# EasyEDA Pro project can-mcu.eprj, board host-dimmer-rgbw
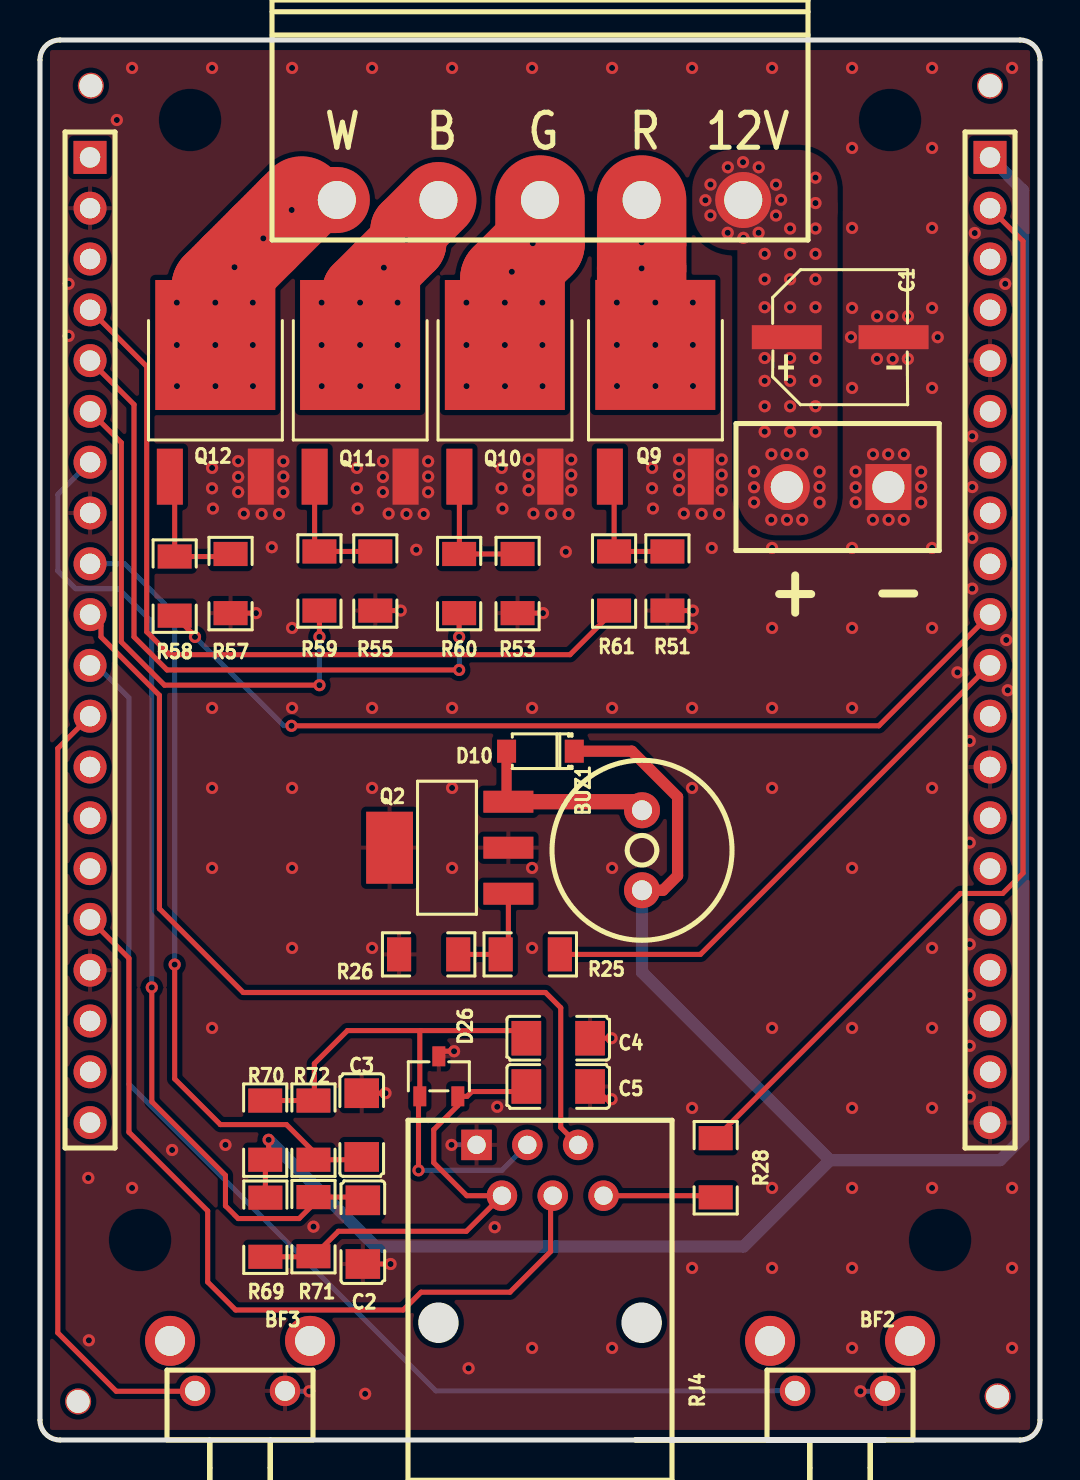
[diagram p13: board, top side]
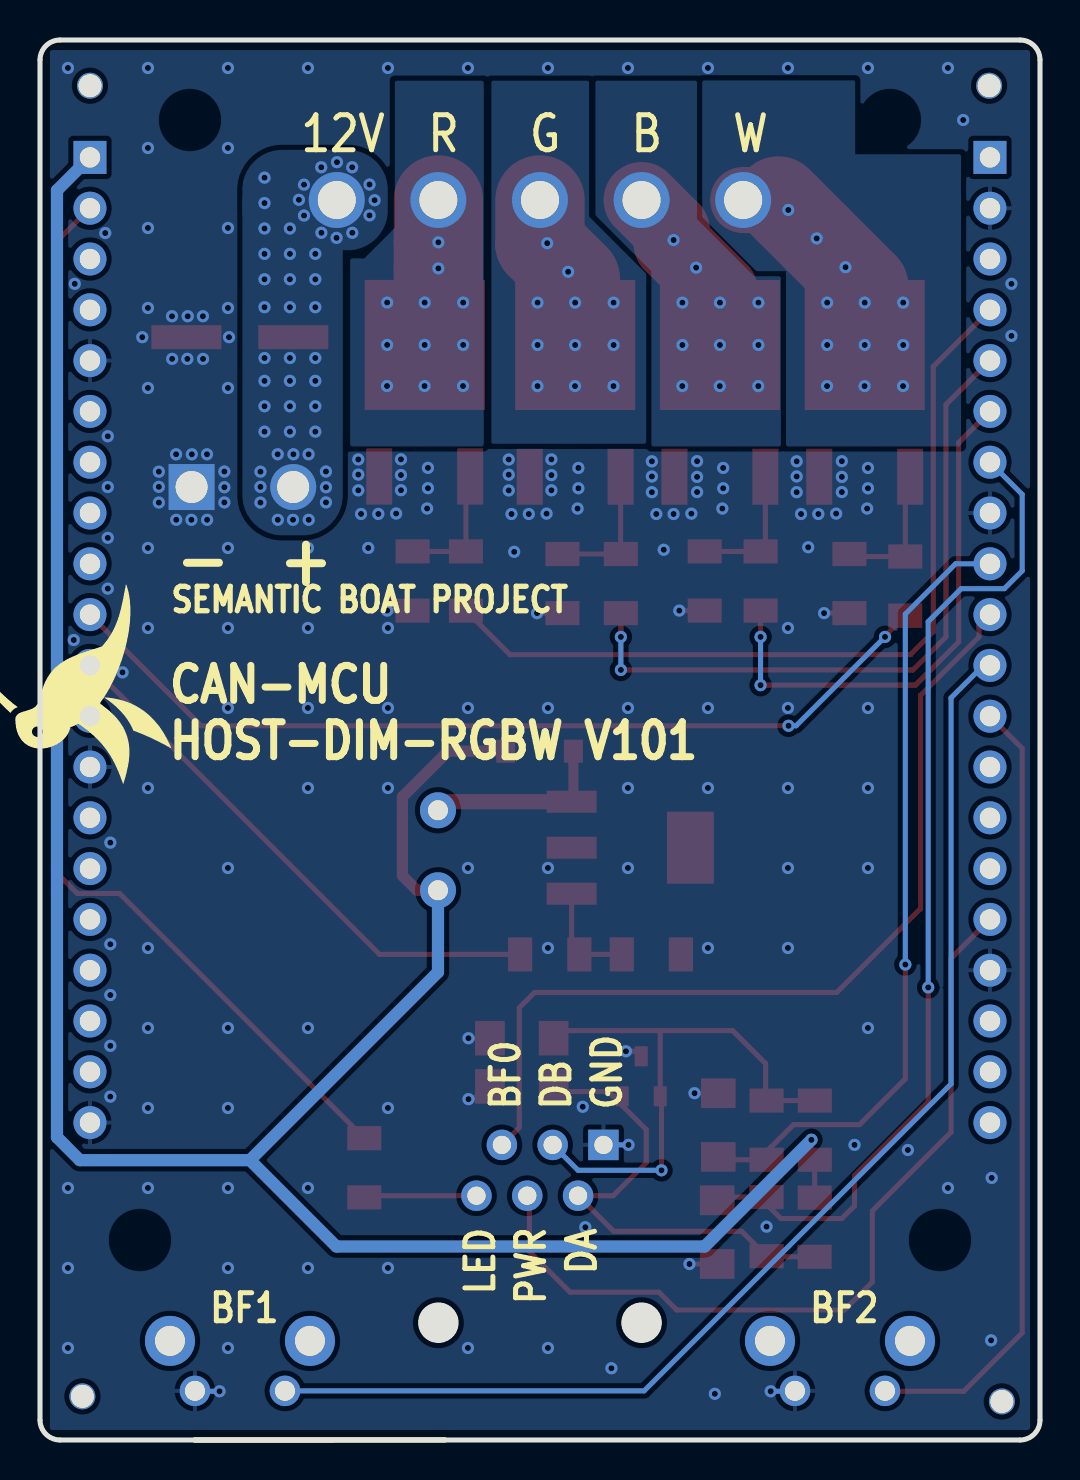
[diagram p14: board, bottom side, seen from below]

Outline 50 x 70 mm; copper layers: Top Layer, Bottom Layer. Coordinates in mm from the lower left corner of the outline.
Outline path: 1,0 arc(0.29,0.29) 0,1 0,69 arc(0.29,69.71) 1,70 49,70 arc(49.71,69.71) 50,69 50,1 arc(49.71,0.29) 49,0 29.76,0 42.26,0 1.02,0
Stack: Top Layer 0.035mm / Dielectric1 1.51mm FR4 er 4.5 / Bottom Layer 0.035mm

## Design rules (mm)
template: Custom Config
spacing copperThickness1oz (default): track to track 0.102, other pairs 0.152 to 0.3
spacing copperThickness2oz: track to track 0.203, other pairs 0.152 to 0.3
track width copperThickness1oz (default): min 0.127, default 0.254, max 5.08
track width copperThickness2oz: min 0.203, default 0.254, max 2.54
differential pair differentialPair (default): width min 0.127, default 0.254, max 2.54; gap min 0.152, default 0.152
via viaSize (default): diameter min 0.5, default 0.61, max 10; hole min 0.3, default 0.305, max 6.3

## Placement (name value [footprint] x y rotation side)
BF2  TC-6615-8-260G  [SW-TH_4P-L7.5-W8.0-P4.50]  40 3.71 180 top
BF3  TC-6615-8-260G  [SW-TH_4P-L7.5-W8.0-P4.50]  10 3.71 180 top
BUZ1  2.7kHz  [BUZ-TH_BD9.0-P4.00-D0.6-FD]  30.1 29.49 90 top
C1  100uF  [CAP-SMD_BD6.3-L6.6-W6.6-LS7.3-FD-H7.7]  40.01 55.14 0 top
C2  10nF  [C1206]  16.14 10.39 90 top
C3  10nF  [C1206]  16.09 15.75 270 top
C4  10nF  [C1206]  25.91 20.09 180 top
C5  10nF  [C1206]  25.91 17.68 180 top
CN3  DB2ERC-5.08-5P-GN  [CONN-TH_5P-P5.08_DB2ERC-5.08-5P]  25 62 180 top
D10  1N4148W  [SOD-123_L2.8-W1.8-LS3.7-RD]  25.02 34.44 180 top
D26  PESD3V3S2UT  [SOT-23-3_L2.9-W1.3-P1.90-LS2.4-BR]  19.94 18.18 270 top
NOREF  -  [Pad_e665]  1.91 1.93 270 top
NOREF#2  -  [Pad_e664]  47.88 2.18 270 top
NOREF#3  -  [Pad_e663]  2.54 67.71 270 top
NOREF#4  -  [Pad_e3264]  47.5 67.71 270 top
Q2  TE060NDG  [SOT-223-3_L6.5-W3.4-P2.30-LS7.0-BR-1]  20.45 29.61 0 top
Q9  AOD4184A  [TO-252-2_L6.6-W6.1-P4.57-LS9.9-TL-CW]  30.77 51.46 90 top
Q10  AOD4184A  [TO-252-2_L6.6-W6.1-P4.57-LS9.9-TL-CW]  23.24 51.46 90 top
Q11  AOD4184A  [TO-252-2_L6.6-W6.1-P4.57-LS9.9-TL-CW]  16 51.46 90 top
Q12  AOD4184A  [TO-252-2_L6.6-W6.1-P4.57-LS9.9-TL-CW]  8.77 51.46 90 top
R25  220Ω  [R1206]  24.51 24.28 180 top
R26  47kΩ  [R1206]  19.43 24.28 0 top
R28  1kΩ  [R1206]  33.78 13.61 90 top
R51  47kΩ  [R1206]  31.37 42.95 270 top
R53  47kΩ  [R1206]  23.88 42.82 270 top
R55  47kΩ  [R1206]  16.77 42.95 270 top
R57  47kΩ  [R1206]  9.53 42.82 270 top
R58  220Ω  [R1206]  6.73 42.69 90 top
R59  220Ω  [R1206]  13.97 42.95 90 top
R60  220Ω  [R1206]  20.96 42.82 90 top
R61  220Ω  [R1206]  28.7 42.95 90 top
R69  10kΩ  [R1206]  11.27 10.64 90 top
R70  10kΩ  [R1206]  11.26 15.49 270 top
R71  1kΩ  [R1206]  13.67 10.67 90 top
R72  1kΩ  [R1206]  13.67 15.49 270 top
RJ4  MTJ-665X1  [RE45-TH_MTJ-665X1]  25 13.48 0 top
U1  PZ508V-11-02P-H25  [HDR-TH_2P-P5.08-V-M]  39.88 47.65 180 top
U3  KH-2.54FH-1X20P-H8.5  [HDR-TH_20P-P2.54-V-F-2]  47.5 40 270 top
U4  KH-2.54FH-1X20P-H8.5  [HDR-TH_20P-P2.54-V-F-2]  2.5 40 270 top

## Footprints (pads in the part's own frame, mm; a bottom-side part is the same pattern mirrored in y, then rotated)
BUZ-TH_BD9.0-P4.00-D0.6-FD
  round 1.8 hole 1: 1(-2,0) 2(2,0)
C1206
  rect 1.485x1.728 smd: 1(-1.593,0) 2(1.593,0)
CAP-SMD_BD6.3-L6.6-W6.6-LS7.3-FD-H7.7
  rect 3.5x1.2 smd: 1(-2.67,0) 2(2.67,0)
CONN-TH_5P-P5.08_DB2ERC-5.08-5P
  round 2.8 hole 1.9: 1(-10.16,0) 2(-5.08,0) 3(0,0) 4(5.08,0) 5(10.16,0)
HDR-TH_2P-P5.08-V-M
  rect 2.3x2.3 hole 1.6: 1(-2.54,0)
  round 2.3 hole 1.6: 2(2.54,0)
HDR-TH_20P-P2.54-V-F-2
  rect 1.65x1.65 hole 1.02: 1(-24.13,0)
  round 1.65 hole 1.02: 2(-21.59,0) 3(-19.05,0) 4(-16.51,0) 5(-13.97,0) 6(-11.43,0) 7(-8.89,0) 8(-6.35,0) 9(-3.81,0) 10(-1.27,0) 11(1.27,0) 12(3.81,0) 13(6.35,0) 14(8.89,0) 15(11.43,0) 16(13.97,0) 17(16.51,0) 18(19.05,0) 19(21.59,0) 20(24.13,0)
Pad_e663
  round 1.3 hole 1.152: 1(0,0)
Pad_e664
  round 1.3 hole 1.152: 1(0,0)
Pad_e665
  round 1.3 hole 1.152: 1(0,0)
Pad_e3264
  round 1.3 hole 1.152: 1(0,0)
R1206
  rect 1.208x1.701 smd: 1(-1.479,0) 2(1.479,0)
RE45-TH_MTJ-665X1
  rect 1.524x1.524 hole 0.914: 1(-3.175,1.27)
  round 1.524 hole 0.914: 2(-1.905,-1.27) 3(-0.635,1.27) 4(0.635,-1.27) 5(1.905,1.27) 6(3.175,-1.27)
SOD-123_L2.8-W1.8-LS3.7-RD
  rect 0.95x1.15 smd: 1(-1.692,0) 2(1.692,0)
SOT-23-3_L2.9-W1.3-P1.90-LS2.4-BR
  rect 1x0.65 smd: 1(1,-0.95) 2(1,0.95) 3(-1,0)
SOT-223-3_L6.5-W3.4-P2.30-LS7.0-BR-1
  rect 2.5x1.1 smd: 1(2.97,-2.3) 2(2.97,0) 3(2.97,2.3)
  rect 2.34x3.6 smd: 2(-2.97,0)
SW-TH_4P-L7.5-W8.0-P4.50
  round 1.524 hole 1: 1(-2.25,1.25) 2(2.25,1.25)
  round 2.5 hole 1.5: 3(-3.5,-1.25) 4(3.5,-1.25)
TO-252-2_L6.6-W6.1-P4.57-LS9.9-TL-CW
  rect 2.8x1.3 smd: 1(-3.292,2.273) 3(-3.292,-2.273)
  rect 6.5x6 smd: 2(3.292,0)

## Nets
+3V3: BUZ1.1 D10.1 R69.2 R70.2 U3.1
+12V: C1.1 CN3.1 U1.2
GND: BF2.1 BF3.1 C1.2 C2.1 C3.1 C4.1 C5.1 D26.3 Q2.2 Q9.3 Q10.3 Q11.3 Q12.3 R26.1 R51.2 R53.2 R55.2 R57.2 RJ4.1 U1.1 U3.5 U3.13 U3.20 U4.2 U4.8 U4.17
BTN_FUN_0: RJ4.5 U4.10
BTN_FUN_1: BF2.2 U4.11
BTN_FUN_2: BF3.2 U4.12
BTN_POWER: RJ4.4 U4.16
DEC_A: C5.2 D26.2 R69.1 R71.1 RJ4.2
DEC_B: C4.2 D26.1 R70.1 R72.1 RJ4.3
GPIO_PA0_T21: C2.2 R71.2 U4.7
GPIO_PA1_T22: C3.2 R72.2 U4.9
GPIO_PA2_T23: R58.1 U3.10
GPIO_PA3_T24: R25.1 U3.11
GPIO_PA4_D_CS: R28.2 U3.2
GPIO_PA8_T11: R61.1 U4.4
GPIO_PA9_T12: R60.1 U4.5
GPIO_PA10_T13: R59.1 U4.6
$1N6097: BUZ1.2 D10.2 Q2.3
$1N6717: Q2.1 R25.2 R26.2
$1N12573: CN3.2 Q9.2
$1N12577: Q9.1 R51.1 R61.2
$1N13127: CN3.3 Q10.2
$1N13130: Q10.1 R53.1 R60.2
$1N13391: CN3.4 Q11.2
$1N13394: Q11.1 R55.1 R59.2
$1N13399: Q12.1 R57.1 R58.2
$1N13465: CN3.5 Q12.2
$1N13717: R28.1 RJ4.6

Pads without a net: BF2 3 4; BF3 3 4; NOREF 1; NOREF#2 1; NOREF#3 1; NOREF#4 1; U3 3 4 6 7 8 9 12 14 15 16 17 18 19; U4 1 3 13 14 15 18 19 20

## Via types
v1: diameter 0.61, hole 0.305, Top Layer to Bottom Layer, 289 vias

## Routing (per net, layer and track width the routed paths; a pad name or vN(x,y) marks a point on that pad's centre or on a via; arc(x,y) is an arc through that point)
+3V3: length 124.3
  Top Layer w0.254: R69.2 11.27,14.01 R70.2 11.43,14.19 v1(11.43,15.01)
  Top Layer w0.559: D10.1 29.59,34.44 31.88,32.15 31.88,28.22 31.15,27.49 BUZ1.1
  Bottom Layer w0.61: BUZ1.1 30.1,23.39 39.5,13.99 ; v1(11.43,15.01) 16.77,9.68 35.18,9.68 39.5,13.99 ; U3.1 49.15,62.48 49.15,15.14 48.01,13.99 39.5,13.99
+12V:
  vias: v1(33.27,61.99) v1(33.52,62.78) v1(33.52,61.23) v1(34.39,63.64) v1(34.39,60.36) v1(35.15,63.89) v1(35.17,60.11) v1(35.7,48.42) v1(35.7,47.64) v1(35.7,46.88) v1(35.94,63.64) v1(35.93,60.36) v1(36.24,59.31) v1(36.24,58.04) v1(36.24,56.64) v1(36.24,54.1) v1(36.24,52.96) v1(36.24,51.69) v1(36.24,50.42) v1(36.57,49.29) v1(36.56,46.01) v1(36.8,62.77) v1(36.8,61.22) v1(37.05,62.01) v1(37.33,49.29) v1(37.35,46.01) v1(37.51,60.58) v1(37.51,59.31) v1(37.51,58.04) v1(37.51,56.64) v1(37.51,54.1) v1(37.51,52.96) v1(37.51,51.69) v1(37.51,50.42) v1(38.12,49.29) v1(38.11,46.01) v1(38.78,63.12) v1(38.78,61.85) v1(38.78,60.58) v1(38.78,59.31) v1(38.78,58.04) v1(38.78,56.64) v1(38.78,54.1) v1(38.78,52.96) v1(38.78,51.69) v1(38.78,50.42) v1(38.98,48.42) v1(38.98,47.66) v1(38.98,46.87)
GND: length 14.6
  Top Layer w0.254: C5.1 27.69,17.68 28.32,17.04 v1(28.58,17.04) ; R53.2 v1(25.15,41.34) ; C2.1 v1(17.53,8.8) ; C3.1 v1(17.27,17.34) ; R51.2 v1(32.64,41.47) ; C4.1 v1(28.58,20.09) ; R55.2 v1(18.04,41.47) ; R57.2 v1(10.8,41.34) ; v1(20.7,19.44) 20.2,19.44 D26.3
  Bottom Layer w0.254: v1(13.46,2.44) 12.27,2.44 BF3.1 ; RJ4.1 v1(20.58,14.75) ; v1(41.02,2.44) 42.23,2.44 BF2.1
  vias: v1(1.43,57.81) v1(1.43,55.21) v1(2.42,13.1) v1(2.44,4.98) v1(3.84,66) v1(4.6,68.6) v1(4.6,12.6) v1(6.61,14.5) v1(8.6,68.6) v1(8.6,48.6) v1(8.6,47.59) v1(8.65,46.57) v1(8.6,36.6) v1(8.6,32.6) v1(8.6,28.6) v1(8.6,20.6) v1(9.27,14.75) v1(9.91,48.94) v1(9.91,48.16) v1(9.91,47.4) v1(10.19,46.32) v1(11.08,46.3) v1(11.59,44.64) v1(11.95,46.3) v1(12.17,48.94) v1(12.17,48.18) v1(12.17,47.39) v1(12.6,68.6) v1(12.6,40.6) v1(12.6,36.6) v1(12.6,32.6) v1(12.6,28.6) v1(12.6,24.6) v1(13.67,10.67) v1(15.84,48.6) v1(15.84,47.59) v1(15.88,46.57) v1(16.26,2.31) v1(16.6,68.6) v1(16.6,36.6) v1(16.6,32.6) v1(16.6,24.6) v1(17.15,48.94) v1(17.15,48.16) v1(17.15,47.4) v1(17.43,46.32) v1(18.32,46.3) v1(18.81,44.51) v1(19.19,46.3) v1(19.41,48.94) v1(19.41,48.18) v1(19.41,47.39) v1(20.6,68.6) v1(20.6,36.6) v1(20.6,32.6) v1(20.6,28.6) v1(21.43,3.59) v1(22.74,10.64) v1(22.86,16.66) v1(23.08,48.6) v1(23.08,47.59) v1(23.12,46.57) v1(24.43,49.03) v1(24.43,48.25) v1(24.43,47.49) v1(24.6,68.6) v1(24.6,36.6) v1(24.6,28.6) v1(24.6,24.6) v1(24.6,4.6) v1(24.67,46.32) v1(25.56,46.3) v1(26.29,44.41) v1(26.43,46.3) v1(26.56,49.02) v1(26.56,48.27) v1(26.56,47.48) v1(28.6,68.6) v1(28.6,36.6) v1(28.6,28.6) v1(28.6,4.6) v1(30.6,48.61) v1(30.6,47.59) v1(30.65,46.58) v1(31.95,49.03) v1(31.95,48.25) v1(31.95,47.49) v1(32.19,46.32) v1(32.6,68.6) v1(32.6,40.6) v1(32.6,36.6) v1(32.6,32.6) v1(32.6,16.6) v1(32.6,8.6) v1(33.08,46.3) v1(33.59,44.6) v1(33.95,46.3) v1(34.09,49.03) v1(34.09,48.27) v1(34.09,47.48) v1(36.6,68.6) v1(36.6,44.6) v1(36.6,40.6) v1(36.6,36.6) v1(36.6,32.6) v1(36.6,20.6) v1(36.6,12.6) v1(36.6,8.6) v1(40.55,55.14) v1(40.6,68.6) v1(40.6,64.6) v1(40.6,60.6) v1(40.6,56.6) v1(40.6,52.6) v1(40.6,44.6) v1(40.6,40.6) v1(40.6,36.6) v1(40.6,28.6) v1(40.6,20.6) v1(40.6,16.6) v1(40.6,12.6) v1(40.6,8.6) v1(40.6,4.6) v1(40.78,48.42) v1(40.78,47.64) v1(40.78,46.88) v1(41.65,49.29) v1(41.64,46.01) v1(41.85,54.06) v1(41.86,56.19) v1(42.41,49.29) v1(42.43,46.01) v1(42.61,56.19) v1(42.63,54.06) v1(43.2,49.29) v1(43.19,46.01) v1(43.4,56.19) v1(43.39,54.06) v1(44.06,48.42) v1(44.06,47.66) v1(44.06,46.87) v1(44.6,68.6) v1(44.6,64.6) v1(44.6,60.6) v1(44.6,56.6) v1(44.6,52.6) v1(44.6,44.6) v1(44.6,40.6) v1(44.6,32.6) v1(44.6,24.6) v1(44.6,20.6) v1(44.6,16.6) v1(44.6,12.6) v1(44.89,55.14) v1(45.87,38.38) v1(46.48,34.95) v1(46.48,29.87) v1(46.48,24.79) v1(46.48,22.25) v1(46.48,19.71) v1(46.48,17.17) v1(46.61,50.19) v1(46.61,47.65) v1(46.61,45.11) v1(46.61,42.57) v1(46.74,60.35) v1(48.26,57.81) v1(48.31,40) v1(48.39,37.49) v1(48.6,68.6) v1(48.6,12.6) v1(48.6,8.6) v1(48.6,4.6)
BTN_FUN_0: length 45.5
  Top Layer w0.254: RJ4.5 26.04,15.62 26.04,21.61 25.28,22.38 10.16,22.38 5.97,26.57 5.97,37.23 3.05,40.16 3.05,40.72 U4.10
BTN_FUN_1: length 61.6
  Bottom Layer w0.254: BF2.2 19.79,2.46 4.45,17.8 4.45,37.11 2.82,38.73 U4.11
BTN_FUN_2: length 39.6
  Top Layer w0.254: BF3.2 7.73,2.44 3.81,2.44 0.89,5.36 0.89,34.58 U4.12
BTN_POWER: length 42.3
  Top Layer w0.254: U4.16 4.45,24.08 4.45,15.39 8.38,11.45 8.38,7.9 9.78,6.5 18.16,6.5 19.05,7.39 23.5,7.39 25.53,9.42 25.53,12.11 RJ4.4
DEC_A: length 24.6
  Top Layer w0.254: R69.1 13.65,9.16 R71.1 14.92,10.44 21.32,10.44 RJ4.2 21.34,12.22 19.69,13.87 19.69,15.52 20.89,16.72 D26.2 21.35,17.18 21.59,17.42 24.06,17.42 C5.2
DEC_B: length 28.7
  Top Layer w0.254: 19.04,20.47 18.99,20.42 D26.1 18.93,17.12 v1(18.93,13.48) ; 19.04,20.47 23.94,20.47 C4.2 ; 19.04,20.47 15.37,20.47 13.72,18.82 13.72,17.02 R72.1 R70.1
  Bottom Layer w0.254: v1(18.93,13.48) 23.1,13.48 RJ4.3
GPIO_PA0_T21: length 50.4
  Top Layer w0.254: v1(5.59,22.63) 5.59,16.91 9.27,13.23 9.27,11.71 9.91,11.07 12.96,11.07 13.67,11.79 R71.2 15.98,12.15 C2.2
  Bottom Layer w0.254: U4.7 0.89,47.28 0.89,43.46 1.78,42.57 3.94,42.57 5.59,40.92 v1(5.59,22.63)
GPIO_PA1_T22: length 39.8
  Top Layer w0.254: v1(6.73,23.77) 6.73,18.06 9.02,15.77 12.32,15.77 13.67,14.42 R72.2 15.95,14.01 C3.2
  Bottom Layer w0.254: U4.9 4.22,43.81 6.73,41.3 v1(6.73,23.77)
GPIO_PA2_T23: length 45.4
  Top Layer w0.254: v1(12.58,35.71) 41.94,35.71 U3.10 ; R58.1 7.75,40.2 v1(7.75,40.16)
  Bottom Layer w0.254: v1(7.75,40.16) 12.19,35.71 v1(12.58,35.71)
GPIO_PA3_T24: length 27.5
  Top Layer w0.254: R25.1 33.02,24.28 47.47,38.73 U3.11
GPIO_PA4_D_CS: length 54.8
  Top Layer w0.254: U3.2 49.15,59.94 49.15,28.34 48.14,27.33 46.02,27.33 R28.2
GPIO_PA8_T11: length 42
  Top Layer w0.254: U4.4 5.34,53.68 5.34,40.41 6.48,39.27 26.5,39.27 R61.1
GPIO_PA9_T12: length 34.5
  Top Layer w0.254: v1(20.96,40.16) R60.1 ; v1(20.96,38.5) 6.35,38.5 4.7,40.16 4.7,51.77 U4.5
  Bottom Layer w0.254: v1(20.96,38.5) v1(20.96,40.16)
GPIO_PA10_T13: length 26.7
  Top Layer w0.254: v1(13.97,37.74) 6.23,37.74 4.07,39.9 4.07,49.87 U4.6 ; v1(13.97,40.16) R59.1
  Bottom Layer w0.254: v1(13.97,37.74) v1(13.97,40.16)
$1N6097: length 9.4
  Top Layer w0.508: Q2.3 23.33,32 D10.2
  Top Layer w0.762: BUZ1.2 29.67,31.91 Q2.3
$1N6717: length 5.3
  Top Layer w0.254: Q2.1 23.42,24.66 R25.2 R26.2
$1N12573: length 7.5
  Top Layer w4.471: CN3.2 v1(30.08,59.88) v1(30.08,58.58) 30.08,55.44 v1(30.77,54.75)
  vias: v1(28.84,56.87) v1(28.84,54.75) v1(28.85,52.7) v1(30.77,56.87) v1(30.77,52.7) v1(32.64,56.87) v1(32.64,54.75) v1(32.65,52.7)
$1N12577: length 6.5
  Top Layer w0.254: R51.1 R61.2 28.7,47.96 Q9.1
$1N13127: length 8
  Top Layer w4.471: v1(23.24,54.75) v1(23.24,56.87) 23.24,58.06 v1(23.59,58.41) 25,59.82 CN3.3
  vias: v1(21.32,56.87) v1(21.32,54.75) v1(21.33,52.69) v1(23.25,52.69) v1(24.64,59.84) v1(25.12,56.87) v1(25.12,54.75) v1(25.13,52.69)
$1N13130: length 6.8
  Top Layer w0.254: R53.1 R60.2 20.97,44.31 Q10.1
$1N13391: length 8.9
  Top Layer w3.8: v1(16,54.75) v1(16,56.87) 16,57.43 v1(17.19,58.62) 18.42,59.84 18.42,60.49 CN3.4
  vias: v1(14.08,56.87) v1(14.08,54.75) v1(14.09,52.69) v1(16.01,52.69) v1(17.88,56.87) v1(17.88,54.75) v1(17.89,52.69) v1(18.32,60)
$1N13394: length 6.6
  Top Layer w0.254: Q11.1 13.73,44.67 R59.2 R55.1
$1N13399: length 6.9
  Top Layer w0.254: R57.1 9.4,44.17 R58.2 6.73,47.92 Q12.1
$1N13465: length 10.8
  Top Layer w3.302: CN3.5 13.08,62
  Top Layer w4.369: 13.08,62 v1(12.59,61.5) v1(11.17,60.08) v1(9.72,58.64) 8.77,57.68 v1(8.77,56.87) v1(8.77,54.75)
  vias: v1(6.84,56.87) v1(6.84,54.75) v1(6.85,52.69) v1(8.77,52.69) v1(10.64,56.87) v1(10.64,54.75) v1(10.65,52.69)
$1N13717: length 5.6
  Top Layer w0.254: 33.78,12.26 33.74,12.22 RJ4.6

## Copper pours and planes (outline as drawn; the poured copper is in the pictures)
+12V on Top Layer: 34.61,59.49 34.33,59.51 34.05,59.57 33.78,59.67 33.53,59.81 33.3,59.98 33.1,60.18 32.93,60.41 32.79,60.66 32.69,60.93 32.63,61.21 32.61,61.49 32.61,62.51 32.63,62.79 32.69,63.07 32.79,63.34 32.93,63.59 33.1,63.82 33.3,64.02 33.53,64.19 33.78,64.33 34.05,64.43 34.33,64.49 34.61,64.51 37.88,64.51 38.17,64.49 38.45,64.43 38.72,64.33 38.97,64.19 39.19,64.02 39.4,63.82 39.57,63.59 39.7,63.34 39.8,63.07 39.86,62.79 39.88,62.51 39.88,61.49 39.86,61.21 39.8,60.93 39.7,60.66 39.57,60.41 39.4,60.18 39.19,59.98 38.97,59.81 38.72,59.67 38.45,59.57 38.17,59.51 37.88,59.49
+12V on Top Layer: 34.86,61.68 34.88,61.97 34.95,62.25 35.04,62.51 35.18,62.76 35.35,62.99 35.55,63.19 35.78,63.37 36.03,63.5 36.3,63.6 36.58,63.66 36.86,63.68 37.88,63.68 38.17,63.66 38.44,63.6 38.71,63.5 38.96,63.37 39.19,63.19 39.39,62.99 39.56,62.76 39.7,62.51 39.8,62.25 39.86,61.97 39.88,61.68 39.88,47.23 39.86,46.95 39.8,46.67 39.7,46.4 39.56,46.15 39.39,45.93 39.19,45.72 38.96,45.55 38.71,45.42 38.44,45.32 38.17,45.26 37.88,45.23 36.86,45.23 36.58,45.26 36.3,45.32 36.03,45.42 35.78,45.55 35.55,45.72 35.35,45.93 35.18,46.15 35.04,46.4 34.95,46.67 34.88,46.95 34.86,47.23
+12V on Bottom Layer: 34.86,61.81 34.88,62.1 34.95,62.37 35.04,62.64 35.18,62.89 35.35,63.12 35.55,63.32 35.78,63.49 36.03,63.63 36.3,63.73 36.58,63.79 36.86,63.81 37.88,63.81 38.17,63.79 38.44,63.73 38.71,63.63 38.96,63.49 39.19,63.32 39.39,63.12 39.56,62.89 39.7,62.64 39.8,62.37 39.86,62.1 39.88,61.81 39.88,47.23 39.86,46.95 39.8,46.67 39.7,46.4 39.56,46.15 39.39,45.93 39.19,45.72 38.96,45.55 38.71,45.42 38.44,45.32 38.17,45.26 37.88,45.23 36.86,45.23 36.58,45.26 36.3,45.32 36.03,45.42 35.78,45.55 35.55,45.72 35.35,45.93 35.18,46.15 35.04,46.4 34.95,46.67 34.88,46.95 34.86,47.23
+12V on Bottom Layer: 34.61,59.49 34.33,59.51 34.05,59.57 33.78,59.67 33.53,59.81 33.3,59.98 33.1,60.18 32.93,60.41 32.79,60.66 32.69,60.93 32.63,61.21 32.61,61.49 32.61,62.51 32.63,62.79 32.69,63.07 32.79,63.34 32.93,63.59 33.1,63.82 33.3,64.02 33.53,64.19 33.78,64.33 34.05,64.43 34.33,64.49 34.61,64.51 37.88,64.51 38.17,64.49 38.45,64.43 38.72,64.33 38.97,64.19 39.19,64.02 39.4,63.82 39.57,63.59 39.7,63.34 39.8,63.07 39.86,62.79 39.88,62.51 39.88,61.49 39.86,61.21 39.8,60.93 39.7,60.66 39.57,60.41 39.4,60.18 39.19,59.98 38.97,59.81 38.72,59.67 38.45,59.57 38.17,59.51 37.88,59.49
GND on Top Layer: -1.52,71.91 51.82,71.91 51.82,-1.25 -1.52,-1.25
GND on Bottom Layer: -1.01,71.27 51.44,71.27 51.44,-0.74 -1.01,-0.74
$1N12573 on Bottom Layer: 32.26,60.6 32.26,67.97 27.82,67.97 27.82,49.68 34.49,49.68 34.49,59.08 33.78,59.08
$1N13127 on Bottom Layer: 27.56,49.81 27.43,49.93 27.43,67.97 22.54,67.97 22.54,61.17 19.69,58.32 19.69,49.81 19.69,49.81
$1N13391 on Bottom Layer: 22.23,61.24 22.23,67.97 17.15,67.97 17.15,61.05 14.29,58.19 12.96,58.19 12.96,49.68 19.43,49.68 19.43,58.44
$1N13465 on Bottom Layer: 16.89,67.98 9.24,67.98 9.24,64.28 3.95,64.28 3.95,49.68 12.7,49.68 12.7,58.44 14.23,58.44 16.89,61.11

## Text on the board
Bottom Silkscreen Layer: SEMANTIC BOAT PROJECT | GND | DB | BF0 | DA | PWR | LED | BF2 | BF1 | W | B | G | R | 12V | CAN-MCU / HOST-DIM-RGBW V101 | + | -
Top Silkscreen Layer: W | B | G | R | 12V | + | -
